# Altium project 1kW_BLDC_Controller.PrjPcb (part 2 of 2)

## Sheet Optocouplers.SchDoc
size A4; SheetNumber: 5; SheetTotal: 9
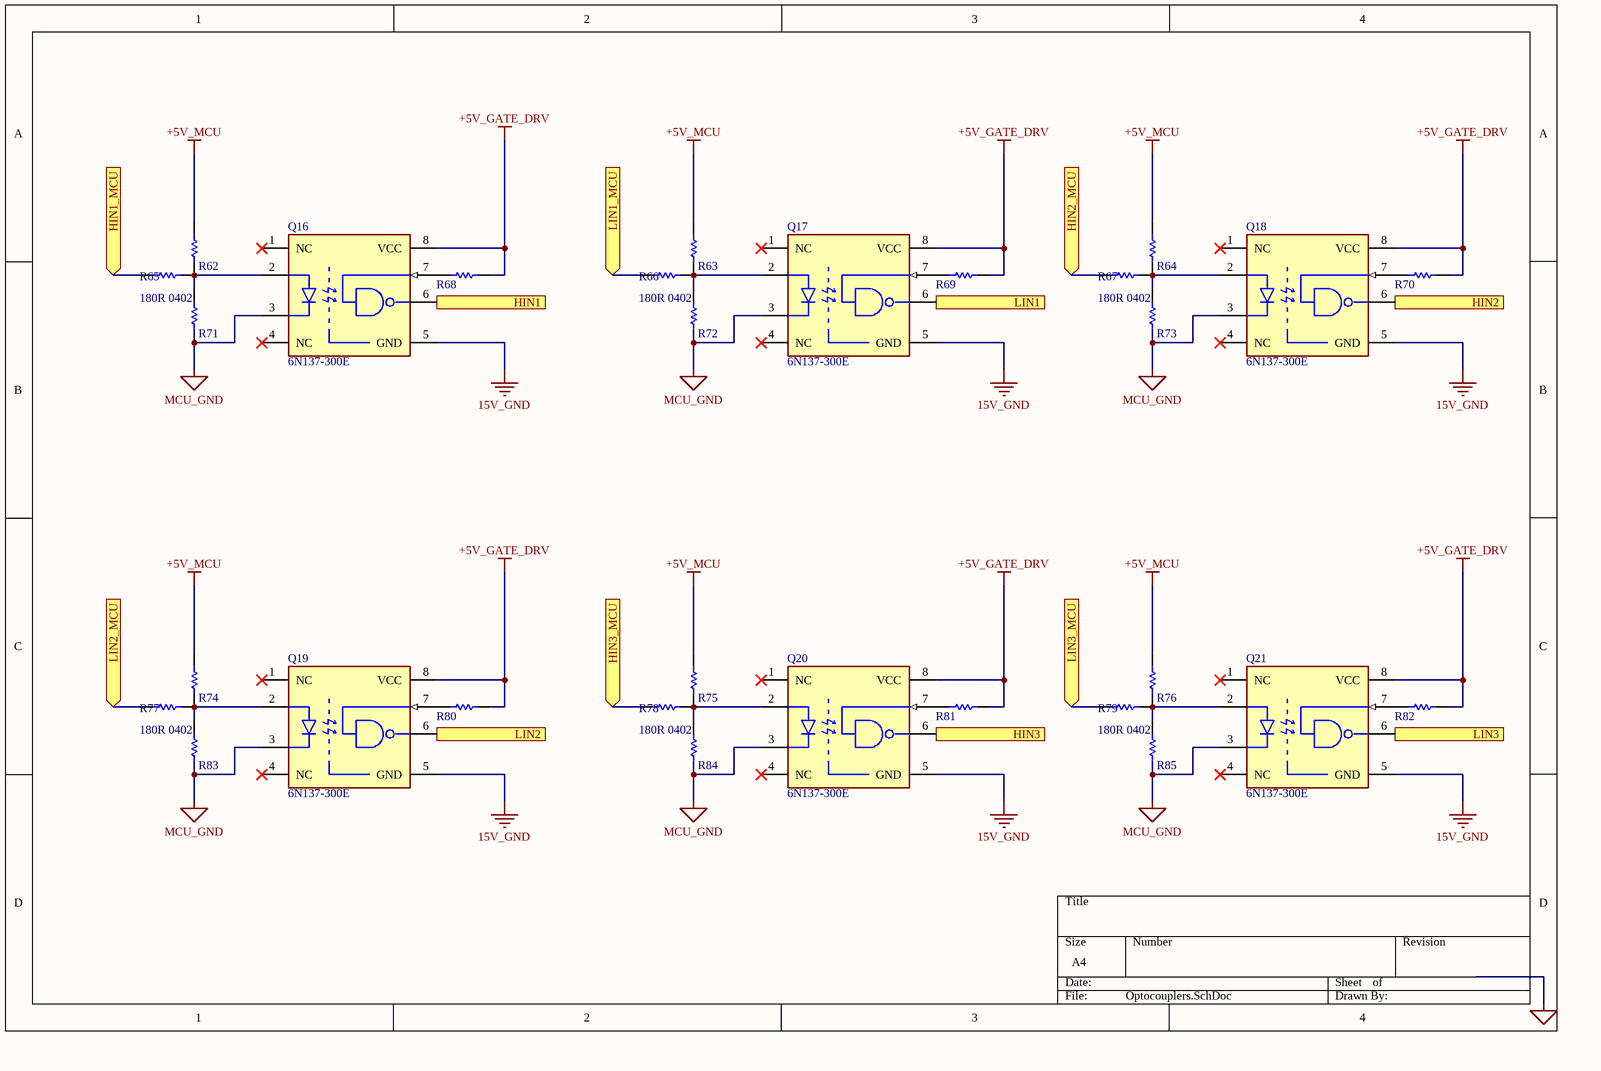
[diagram p4: Optocouplers.SchDoc]

### Parts
Q16  6N137-300E  [FP-6N137-300E-MFG]
Q17  6N137-300E  [FP-6N137-300E-MFG]
Q18  6N137-300E  [FP-6N137-300E-MFG]
Q19  6N137-300E  [FP-6N137-300E-MFG]
Q20  6N137-300E  [FP-6N137-300E-MFG]
Q21  6N137-300E  [FP-6N137-300E-MFG]
R62  0R 0603  [R0603]  (value not drawn)
R63  0R 0603  [R0603]  (value not drawn)
R64  0R 0603  [R0603]  (value not drawn)
R65  180R 0402  [R08050402]
R66  180R 0402  [R08050402]
R67  180R 0402  [R08050402]
R68  0R 0603  [R0603]  (value not drawn)
R69  0R 0603  [R0603]  (value not drawn)
R70  0R 0603  [R0603]  (value not drawn)
R71  0R 0603  [R0603]  (value not drawn)
R72  0R 0603  [R0603]  (value not drawn)
R73  0R 0603  [R0603]  (value not drawn)
R74  0R 0603  [R0603]  (value not drawn)
R75  0R 0603  [R0603]  (value not drawn)
R76  0R 0603  [R0603]  (value not drawn)
R77  180R 0402  [R08050402]
R78  180R 0402  [R08050402]
R79  180R 0402  [R08050402]
R80  0R 0603  [R0603]  (value not drawn)
R81  0R 0603  [R0603]  (value not drawn)
R82  0R 0603  [R0603]  (value not drawn)
R83  0R 0603  [R0603]  (value not drawn)
R84  0R 0603  [R0603]  (value not drawn)
R85  0R 0603  [R0603]  (value not drawn)

### Ports
HIN1 (out), HIN1_MCU (in), HIN2 (out), HIN2_MCU (in), HIN3 (out), HIN3_MCU (in), LIN1 (out), LIN1_MCU (in), LIN2 (out), LIN2_MCU (in), LIN3 (out), LIN3_MCU (in)

### Nets
15V_GND: Q16.5(GND) Q17.5(GND) Q18.5(GND) Q19.5(GND) Q20.5(GND) Q21.5(GND)
+5V_GATE_DRV: Q16.8(VCC) Q17.8(VCC) Q18.8(VCC) Q19.8(VCC) Q20.8(VCC) Q21.8(VCC) R68.2 R69.2 R70.2 R80.2 R81.2 R82.2
+5V_MCU: R62.2 R63.2 R64.2 R74.2 R75.2 R76.2
MCU_GND: Q16.3(C) Q17.3(C) Q18.3(C) Q19.3(C) Q20.3(C) Q21.3(C) R71.1 R72.1 R73.1 R83.1 R84.1 R85.1  [project net A_GND]
NetH8_54: R79.1 ; port LIN3_MCU
NetH8_56: R77.1 ; port LIN2_MCU
NetH8_58: R66.1 ; port LIN1_MCU
NetH8_60: R78.1 ; port HIN3_MCU
NetH8_62: R67.1 ; port HIN2_MCU
NetH8_64: R65.1 ; port HIN1_MCU
NetQ16_2: Q16.2(A) R62.1 R65.2 R71.2
NetQ16_6: Q16.6(VO) ; port HIN1
NetQ16_7: Q16.7(VE) R68.1
NetQ17_2: Q17.2(A) R63.1 R66.2 R72.2
NetQ17_6: Q17.6(VO) ; port LIN1
NetQ17_7: Q17.7(VE) R69.1
NetQ18_2: Q18.2(A) R64.1 R67.2 R73.2
NetQ18_6: Q18.6(VO) ; port HIN2
NetQ18_7: Q18.7(VE) R70.1
NetQ19_2: Q19.2(A) R74.1 R77.2 R83.2
NetQ19_6: Q19.6(VO) ; port LIN2
NetQ19_7: Q19.7(VE) R80.1
NetQ20_2: Q20.2(A) R75.1 R78.2 R84.2
NetQ20_6: Q20.6(VO) ; port HIN3
NetQ20_7: Q20.7(VE) R81.1
NetQ21_2: Q21.2(A) R76.1 R79.2 R85.2
NetQ21_6: Q21.6(VO) ; port LIN3
NetQ21_7: Q21.7(VE) R82.1

Not connected (* = marked no-connect by the designer): Q16 1(NC)* 4(NC)*; Q17 1(NC)* 4(NC)*; Q18 1(NC)* 4(NC)*; Q19 1(NC)* 4(NC)*; Q20 1(NC)* 4(NC)*; Q21 1(NC)* 4(NC)*

### Library data of the parts
Q16-Q21 = CMP-18400-000015-1: 6N137 – High-Speed Optocoupler-SOP8; Manufacturer: Broadcom; Min Supply Voltage: 4.5V; Forward Voltage: 1.5V; Turn Off Delay Time: 50ns; Standoff Height: 0.505mm; Reverse Voltage: 5V; Isolation Voltage: 3750Vrms; Forward Current: 10mA; Turn On Delay Time: 48ns; Max Supply Voltage: 5.5V; Package: 0; Automotive: No; Lead Free: Yes; ComponentLink2Description: Datasheet; Temperature: -40°C to +85°C; Device Class L3: unset; Height: 4.455mm; Ambient Temperature Range Low: -40°C; Digikey Description: OPTOISO 3.75KV OPN COLL 8DIP GW; Temperature Range Low: -40°C; ComponentLink2URL: https://docs.broadcom.com/docs/AV02-0940EN; Mouser Description: High Speed Optocouplers 10 Mb/s 3750Vrms; Category: Trans; Ambient Temperature Range High: +85°C; RoHS: TRUE; Octopart: https://octopart.com/6n137-300e-broadcom-71125550; Manufacturer Part Number: 6N137-300E; Device Class L1: Optoelectronics; Device Class L2: Optocouplers; Temperature Range High: +85°C; Price per piece: 36; Product URL: https://sharvielectronics.com/product/6n137-high-speed-optocoupler-sop8/; Datasheet: https://sharvielectronics.com/wp-content/uploads/2020/11/6n137.pdf
  Q17-Q21: Parameter 1: *
R62-R64 R68-R76 R80-R85 = R0000 0603: 0 Ohm 1/10 Watt Resistor 1% Tolerance RC0603FR-070RL – 0603 Package; Price per piece: 0.97; Product URL: https://sharvielectronics.com/product/0-ohm-1-10-watt-resistor-1-tolerance-rc0603fr-070rl-0603-package/; Datasheet: https://drive.google.com/file/d/1pkLQT_RQ1i35oFQcGREpZr7Oy3Ppi-ZT/view?usp=sharing
R65-R67 R77-R79 = R0805-0402: 180 Ohm 1/4 Watt Resistor – 0402 Package; Price per piece: 0.85; Product URL: https://sharvielectronics.com/product/180-ohm-1-4-watt-resistor-0402-package-pack-of-20/; Datasheet: https://sharvielectronics.com/wp-content/uploads/2020/09/smd_Resistor_0603_0805_1206.pdf

## Sheet optocouplers2.SchDoc
size A4; SheetNumber: 6; SheetTotal: 9
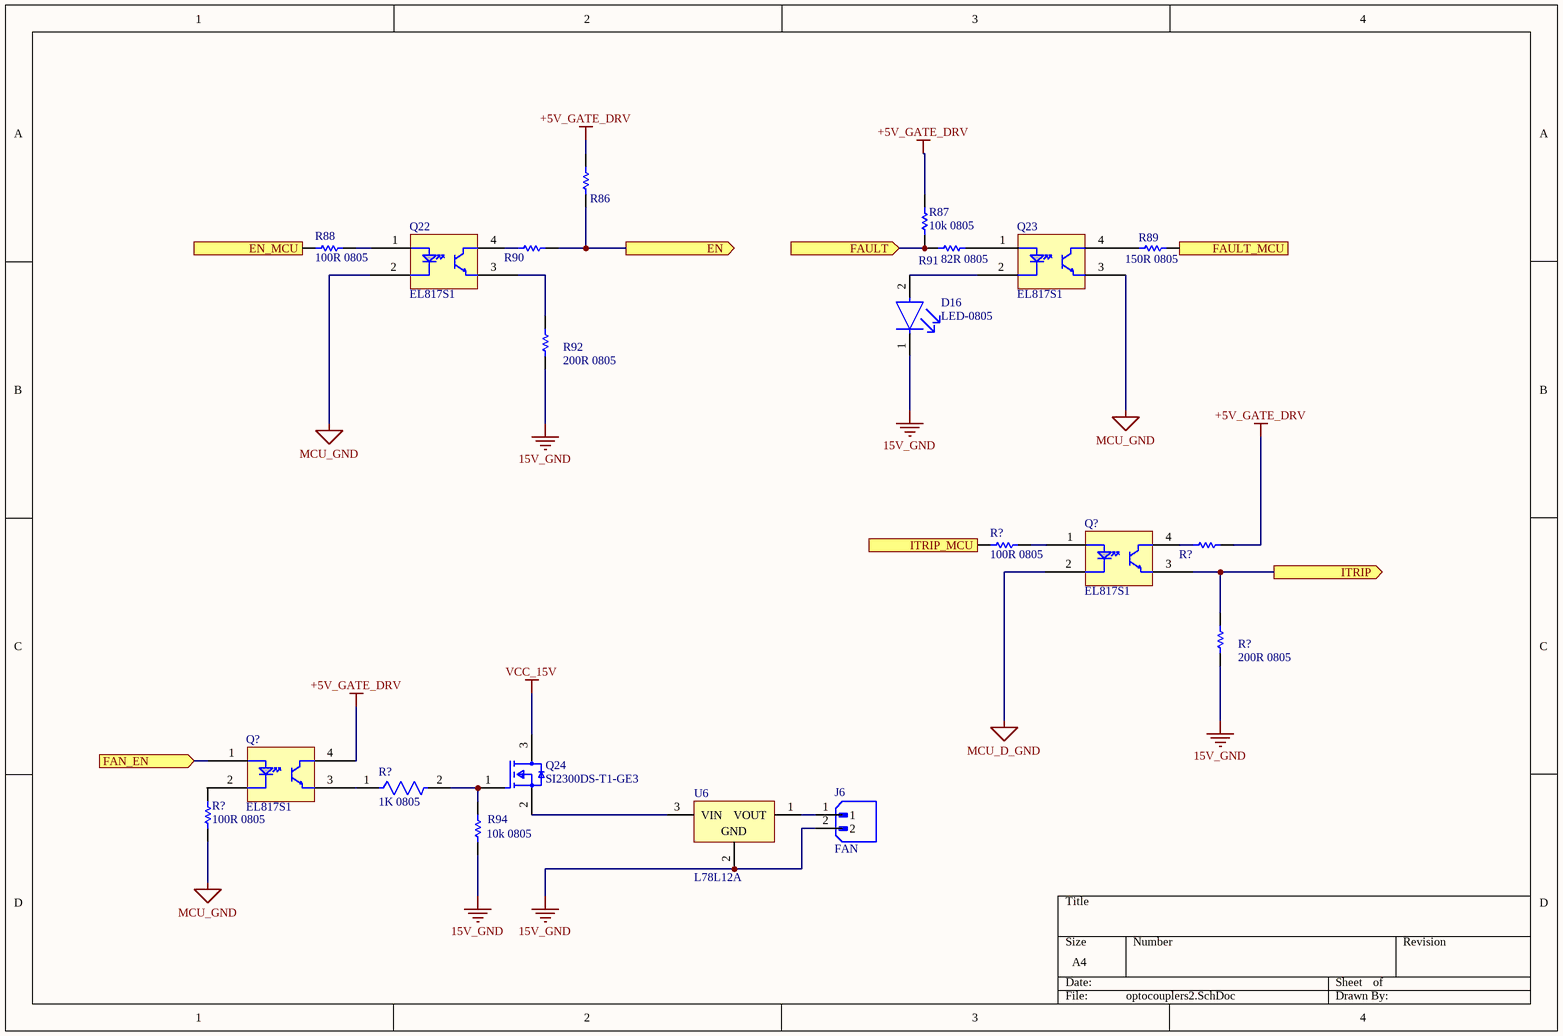
[diagram p5: optocouplers2.SchDoc]

### Parts
(Parts that share a designator on the sheet are numbered #1, #2 ... from top to bottom, then left to right.)
D16  LED-0805  [LED0805]
J6  FAN  [XH2.5-2p]
Q22  EL817S1  [EL817S1]
Q23  EL817S1  [EL817S1]
Q24  SI2300DS-T1-GE3  [FP-S-03946-MFG]
Q?#1  EL817S1  [EL817S1]
Q?#2  EL817S1  [EL817S1]
R86  0R 0603  [R0603]  (value not drawn)
R87  10k 0805  [R0805]
R88  100R 0805  [R0805]
R89  150R 0805  [R0805]
R90  0R 0603  [R0603]  (value not drawn)
R91  82R 0805  [R0805]
R92  200R 0805  [R0805]
R94  10k 0805  [R0805]
R?#2  100R 0805  [R0805]
R?#3  0R 0603  [R0603]  (value not drawn)
R?#4  200R 0805  [R0805]
R?#5  1K 0805  [R0805]
R?#6  100R 0805  [R0805]
U6  L78L12A  [SOT-89_L]

### Ports
EN (out), EN_MCU (in), FAN_EN (in), FAULT (in), FAULT_MCU (out), ITRIP (out), ITRIP_MCU (in)

### Nets
15V_GND: D16.1(C) J6.2 R92.1 R94.1 R?#4.1 U6.2(GND)
+5V_GATE_DRV: Q?#2.4(C) R86.2 R87.2 R?#3.2
MCU_D_GND: Q?#1.2(K)
MCU_GND: Q22.2(K) Q23.3(E) R?#6.1  [project net A_GND]
VCC_15V: Q24.3(D)
NetD16_2: D16.2(A) Q23.2(K)
NetH8_47: Q?#2.1(A) ; port FAN_EN
NetH8_50: R88.1 ; port EN_MCU
NetH8_51: R89.2 ; port FAULT_MCU
NetJ6_1: J6.1 U6.1(VOUT)
NetQ22_1: Q22.1(A) R88.2
NetQ22_3: Q22.3(E) R92.2
NetQ22_4: Q22.4(C) R90.1
NetQ23_1: Q23.1(A) R91.2
NetQ23_4: Q23.4(C) R89.1
NetQ24_1: Q24.1(G) R94.2 R?#5.2
NetQ24_2: Q24.2(S) U6.3(VIN)
NetQ?#1_1: Q?#1.1(A) R?#2.2
NetQ?#1_3: Q?#1.3(E) R?#4.2 ; port ITRIP
NetQ?#1_4: Q?#1.4(C) R?#3.1
NetQ?#2_3: Q?#2.3(E) R?#5.1
NetR32_1: R86.1 R90.2 ; port EN
NetR33_1: R87.1 R91.1 ; port FAULT
NetR38_2: R?#2.1 ; port ITRIP_MCU

Not connected (* = marked no-connect by the designer): Q?#2 2(K); R?#6 2

### Library data of the parts
D16 = LED-0805: Red LED – 0805 SMD Package – 17-21SURC/S530-A3/TR8; Price per piece: 2.32; Product URL: https://sharvielectronics.com/product/red-led-0805-smd-package-17-21surc-s530-a3-tr8/; Datasheet: https://drive.google.com/file/d/193qGY45iPx2JlzACJk7ZLn2axHlG04VY/view?usp=sharing
J6 = XH2.5-2p: 2 Pin JST-XH Male Straight 2515 Connector 2.54mm Pitch; Price per piece: 1.65; Product URL: https://sharvielectronics.com/product/2-pin-jst-xh-male-straight-2515-connector-2-54mm-pitch/; Datasheet: https://sharvielectronics.com/wp-content/uploads/2021/01/XH-Connector.pdf
Q22 Q23 Q?#1 Q?#2 = EL817S1: EL817S1 (B) (TU) – F Optocoupler SMD-4 Cut Tape; Product URL: https://sharvielectronics.com/product/el817s1-b-tu-f-optocoupler-smd-4-cut-tape/; Price per piece: 7.45; Datasheet: https://sharvielectronics.com/wp-content/uploads/2021/09/EL817-Optocoupler.pdf
Q24 = CMP-02550-000182-1: SI2300DS 30V 3.6A N-Channel Mosfet – SOT-23 Package; Manufacturer: Vishay; Threshold Vgs Max: 1.5V; Max Forward Diode Voltage: 1.2V; Max Junction Temp: +150°C; Reverse Recovery Time: 11ns; Depletion Mode: False; Standoff Height: 0.01mm; Gate To Source Voltage: 12V; Input Capacitace At Vds: 320pF @ 15V; Turn Off Delay Time: 15ns; Threshold Vgs Min: 0.6V; Transconductance: 13S; Gate Charge At Vgs: 6.5nC @ 10V; Power Dissipation: 1.1W; Drain To Source Resistance: 0.055Ω; Number Of N Channels: 1; Pulse Drain Current: 15A; Continuous Drain Current: 3.1A; Typ Forward Diode Voltage: 0.8V; Reverse Recovery Charge: 5nC; Rthja Max: 90°C/W; Turn On Delay Time: 5ns; Device Class L2: Transistors; Digikey Description: MOSFET N-CH 30V 3.6A SOT-23; Device Class L3: MOSFETs; ComponentLink2Description: Datasheet; Height: 1.12mm; Temperature Range Low: -55°C; Package: S-03946; Device Class L1: Discrete Semiconductors; RoHS: TRUE; ComponentLink2URL: http://www.vishay.com/docs/65701/si2300ds.pdf; Category: Trans; Drain To Source Breakdown Voltage: 30V; Automotive: No; Number Of Channels: 1; Mouser Description: MOSFET 30V 3.6A N-CH MOSFET; Temperature: -55°C to +150°C; Manufacturer Part Number: SI2300DS-T1-GE3; Octopart: https://octopart.com/si2300ds-t1-ge3-vishay-44451512; Drain To Source Voltage: 30V; Lead Free: Yes; Temperature Range High: +150°C; Ipc Land Pattern Name: SOT95P237X100-3; Price per piece: 12.5; Product URL: https://sharvielectronics.com/product/si2300ds-30v-3-6a-n-channel-mosfet-sot-23-package/; Datasheet: https://www.vishay.com/docs/65701/si2300ds.pdf
R86 R90 R?#3 = R0000 0603: as R62 on sheet Optocouplers; Price per piece: 0.97; Product URL: https://sharvielectronics.com/product/0-ohm-1-10-watt-resistor-1-tolerance-rc0603fr-070rl-0603-package/; Datasheet: https://drive.google.com/file/d/1pkLQT_RQ1i35oFQcGREpZr7Oy3Ppi-ZT/view?usp=sharing
R87 R94 = 10k 0805: 10K Ohm 1/8 Watt Resistor 1% Tolerance RC0805FR-0710KL – 0805 Package; Price per piece: 0.82; Product URL: https://sharvielectronics.com/product/10k-ohm-1-8-watt-resistor-1-tolerance-rc0805fr-0710kl-0805-package/; Datasheet: https://drive.google.com/file/d/1pkLQT_RQ1i35oFQcGREpZr7Oy3Ppi-ZT/view?usp=sharing
R88 R?#2 R?#6 = 100R 0805: 100 ohm 1/4W Resistor 0805 Package; Price per piece: 0.82; Product URL: https://sharvielectronics.com/product/100-ohm-1-4w-resistor-0805-package/; Datasheet: *
R89 = R0805: 510 Ohm 1/8 Watt Resistor 1% Tolerance 0805S8F5100T5E – 0805 Package; Price per piece: 0.85; Product URL: https://sharvielectronics.com/product/510-ohm-1-8-watt-resistor-1-tolerance-0805s8f5100t5e-0805-package/; Datasheet: https://drive.google.com/file/d/1rtx85iFJaMrDbsv7PAzG9bTFItPmAE38/view
R91 = R0805: 82 ohm – 1/4W – Resistor – 0805; Price per piece: 0.82; Product URL: https://sharvielectronics.com/product/82-ohm-1-4w-resistor-pack-of-20-smd-0805/; Datasheet: https://sharvielectronics.com/wp-content/uploads/2020/09/smd_Resistor_0603_0805_1206.pdf
R92 R?#4 = R0805: 200 Ohm 1/8 Watt Resistor 1% Tolerance 0805W8F2000TE – 0805 Package; Price per piece: 0.82; Product URL: https://sharvielectronics.com/product/200-ohm-1-8-watt-resistor-1-tolerance-0805w8f2000te-0805-package/; Datasheet: https://drive.google.com/file/d/1rtx85iFJaMrDbsv7PAzG9bTFItPmAE38/view?usp=sharing
R?#5 = 1k 0805: 1K Ohm 1/8 Watt Resistor 1% Tolerance 0805S8F1001T5E – 0805 Package; Price per piece: 0.82; Product URL: https://sharvielectronics.com/product/1k-ohm-1-8-watt-resistor-1-tolerance-0805s8f1001t5e-0805-package/; Datasheet: https://drive.google.com/file/d/1rtx85iFJaMrDbsv7PAzG9bTFItPmAE38/view?usp=sharing
U6 = CMP-0244-00387-1: 78L12 – 12V 150mA Positive Voltage Regulator-SOT-89 Package; DatasheetVersion: 1/02/2011; PackageDescription: 3-Pin SOT-89 Package 1.5 mm Pitch, 4.1 mm Lead Span; ComponentLink2Description: Datasheet; ComponentLink1Description: Manufacturer URL; PackageVersion: 2011; PackageReference: SOT-89; ComponentLink1URL: http://www.st.com; ComponentLink2URL: http://www.st.com/internet/com/TECHNICAL_RESOURCES/TECHNICAL_LITERATURE/DATASHEET/CD00000446.pdf; Price per piece: 13.32; Product URL: https://sharvielectronics.com/product/78l12-12v-150ma-positive-voltage-regulator-sot-89-package/; Datasheet: https://drive.google.com/file/d/1zOSy_FqMAdv1iXKmyJwn0G3RjMYeVW2a/view?usp=sharing

## Sheet Precharge circuit.SchDoc
size A4; SheetNumber: 7; SheetTotal: 9
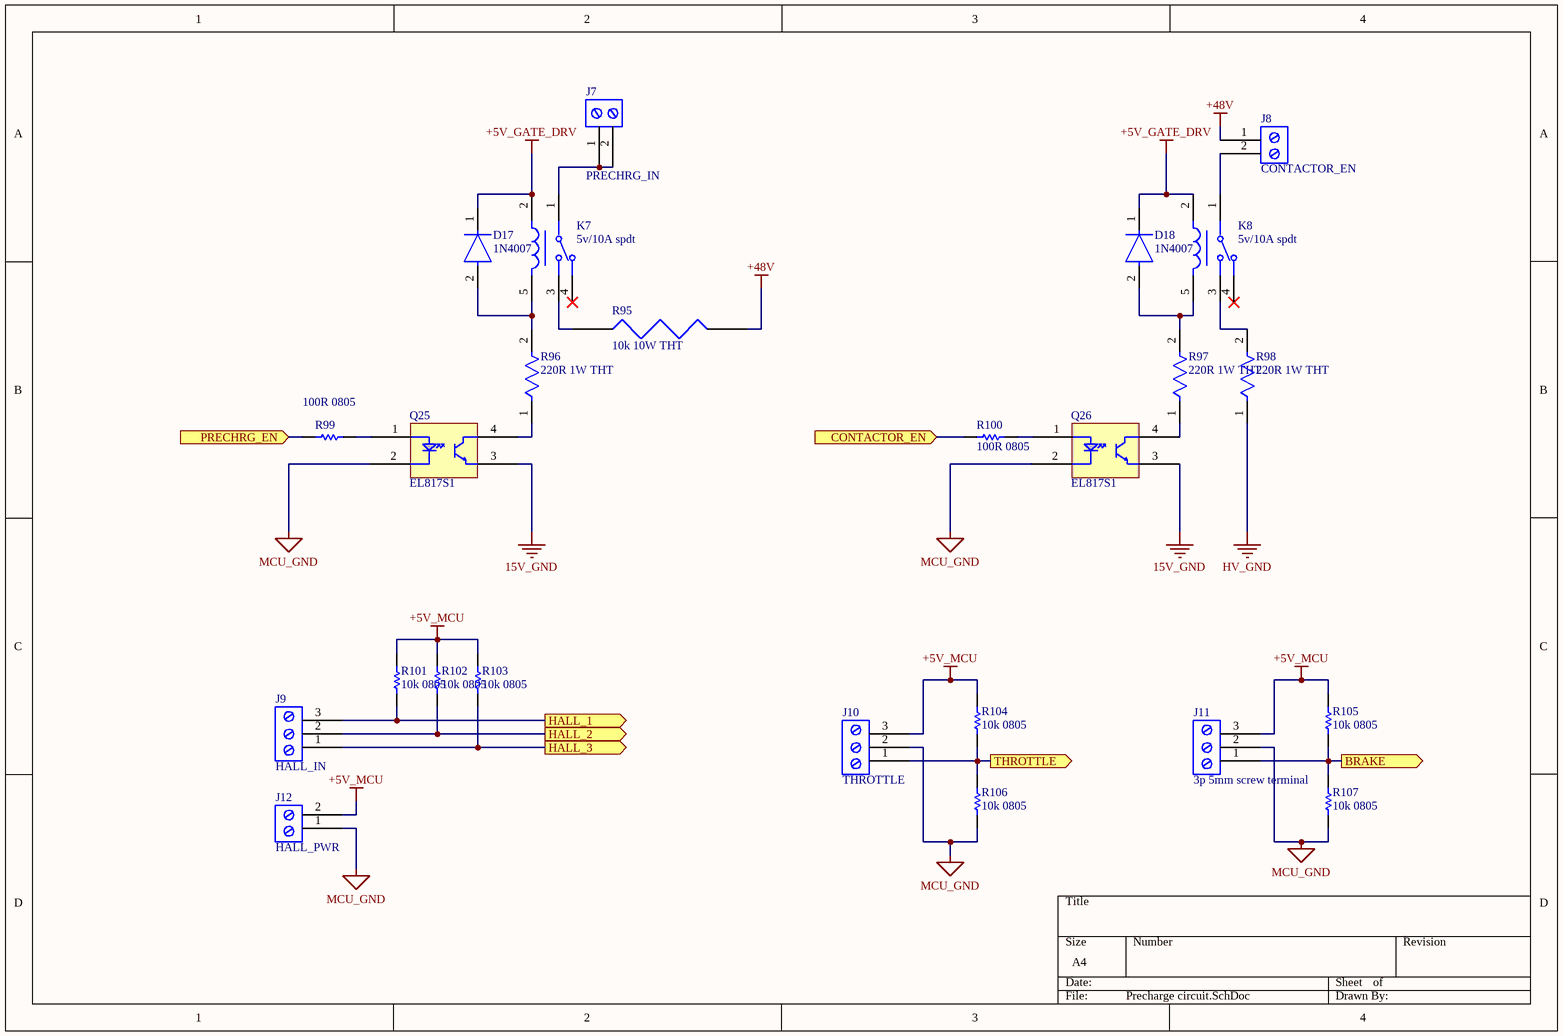
[diagram p6: Precharge circuit.SchDoc]

### Parts
D17  1N4007  [FP-1N4007-MFG]
D18  1N4007  [FP-1N4007-MFG]
J7  PRECHRG_IN  [TERMINAL_5MM_2P]
J8  CONTACTOR_EN  [TERMINAL_5MM_2P]
J9  HALL_IN  [TERMINAL_5MM_3P]
J10  THROTTLE  [TERMINAL_5MM_3P]
J11  3p 5mm screw terminal  [TERMINAL_5MM_3P]
J12  HALL_PWR  [TERMINAL_5MM_2P]
K7  5v/10A spdt  [FP-G5LE-1-E-36-DC5-MFG]
K8  5v/10A spdt  [FP-G5LE-1-E-36-DC5-MFG]
Q25  EL817S1  [EL817S1]
Q26  EL817S1  [EL817S1]
R95  10k 10W THT  [R10W]
R96  220R 1W THT  [R1WTHT]
R97  220R 1W THT  [R1WTHT]
R98  220R 1W THT  [R1WTHT]
R99  100R 0805  [R0805]
R100  100R 0805  [R0805]
R101  10k 0805  [R0805]
R102  10k 0805  [R0805]
R103  10k 0805  [R0805]
R104  10k 0805  [R0805]
R105  10k 0805  [R0805]
R106  10k 0805  [R0805]
R107  10k 0805  [R0805]

### Ports
BRAKE (out), CONTACTOR_EN (in), HALL_1 (out), HALL_2 (out), HALL_3 (out), PRECHRG_EN (in), THROTTLE (out)

### Nets
15V_GND: Q25.3(E) Q26.3(E)
+5V_GATE_DRV: D17.1(C) D18.1(C) K7.2 K8.2
+5V_MCU: J10.3 J11.3 J12.2 R101.2 R102.2 R103.2 R104.2 R105.2
+48V: J8.1 R95.2
HV_GND: R98.1
MCU_GND: J10.2 J11.2 J12.1 Q25.2(K) Q26.2(K) R106.1 R107.1  [project net A_GND]
NetD17_2: D17.2(A) K7.5 R96.2
NetD18_2: D18.2(A) K8.5 R97.2
NetH8_19: J10.1 R104.1 R106.2 ; port THROTTLE
NetH8_21: J11.1 R105.1 R107.2 ; port BRAKE
NetH8_29: J9.3 R101.1 ; port HALL_1
NetH8_30: J9.2 R102.1 ; port HALL_2
NetH8_31: J9.1 R103.1 ; port HALL_3
NetH8_48: R100.1 ; port CONTACTOR_EN
NetH8_49: R99.1 ; port PRECHRG_EN
NetJ7_1: J7.1 J7.2 K7.1
NetJ8_2: J8.2 K8.1
NetK7_3: K7.3 R95.1
NetK8_3: K8.3 R98.2
NetQ25_1: Q25.1(A) R99.2
NetQ25_4: Q25.4(C) R96.1
NetQ26_1: Q26.1(A) R100.2
NetQ26_4: Q26.4(C) R97.1

Not connected (* = marked no-connect by the designer): K7 4*; K8 4*

### Library data of the parts
D17 D18 = CMP-123542-000001-1: GOOD-ARK 1N4007 General Purpose Rectifier Diode – DO-41 Package; Manufacturer: Diotec; Max Surge Forward Current: 27A; Forward Current: 1A; Max Junction Temp: +175°C; Reverse Voltage: 1000V; Value: 15pF; Peak Reverse Current: 5uA; Category: Diode; Temperature Range Low: -50°C; Automotive: No; Temperature: -50°C to +175°C; Lead Free: Yes; ComponentLink2Description: Datasheet; Max Repetitive Reverse Voltage: 1000V; ComponentLink2URL: https://datasheet.octopart.com/1N4007-Diotec-datasheet-62346875.pdf; Manufacturer Part Number: 1N4007; Device Class L3: Rectifier Diodes; Height: 2.8mm; Octopart: https://octopart.com/1n4007-diotec-4040411; Package: 1N4007; Temperature Range High: +175°C; Device Class L1: Discrete Semiconductors; Device Class L2: Diodes; RoHS: TRUE; Capacitance: 15pF; Ipc Land Pattern Name: DIOAD888W100L520D280; Product URL: https://sharvielectronics.com/product/good-ark-1n4007-general-purpose-rectifier-diode-do-41-package/; Price per piece: 1.29; Datasheet: https://sharvielectronics.com/wp-content/uploads/2020/02/1N4007-Diode-Good-Ark.pdf
J7 J8 J12 = 2p 5mm screw terminal: XY127- 2 Pin Screw Terminal- 5mm Pitch; Product URL: https://sharvielectronics.com/product/2-pin-screw-terminal-block-red-5mm-pitch/; Price per piece: 6.32; Datasheet: https://sharvielectronics.com/wp-content/uploads/2023/03/XY127.pdf
J9-J11 = 3p 5mm screw terminal: XY127- 3 Pin Screw Terminal- 5mm Pitch; Product URL: https://sharvielectronics.com/product/xy127-3-pin-screw-terminal-5mm-pitch/; Price per piece: 8.35; Datasheet: https://sharvielectronics.com/wp-content/uploads/2023/03/XY127.pdf
K7 K8 = CMP-08822-000056-1: HF3FF/005-1ZST – 05V 10A SPDT Relay – Hongfa; Coil Voltage (DC): 5V; Coil Type: Non-Latching; Relay Type: General Purpose; Power Consumption: 400mW; Coil Resistance: 70R; Release Time: 5ms; Coil Current: 72mA; Coil Power: 360mW; Operate Time: 10ms; Contact Current Rating: 16A; Max Operating Temperature: 85°C; Contact Material: Tin; Package Quantity: 100; Throw Configuration: SPDT; Termination: PC Pin; Series: G5LE-E; Packaging: Tray; Min Operating Temperature: -40°C; Mount: Through Hole; Price per piece: 29.23; Product URL: https://sharvielectronics.com/product/hf3ff-005-1zst-05v-10a-spdt-relay-hongfa/; Datasheet: https://drive.google.com/file/d/1_hoLs5DHKocXjc-HuLXelOv-fi3k6HGm/view?usp=sharing
Q25 Q26 = EL817S1: as Q22 on sheet optocouplers2; Product URL: https://sharvielectronics.com/product/el817s1-b-tu-f-optocoupler-smd-4-cut-tape/; Price per piece: 7.45; Datasheet: https://sharvielectronics.com/wp-content/uploads/2021/09/EL817-Optocoupler.pdf
R95 = 10k_10W_THT: 10K ohm 10W Fusible Cement Resistor; Price per piece: 20; Product URL: https://sharvielectronics.com/product/10k-ohm-10w-fusible-cement-resistor/; Datasheet: *
R96-R98 = 220R 1W THT: 220 Ohm 1 Watt Resistor 5% Tolerance; Price per piece: 1.46; Product URL: https://sharvielectronics.com/product/220-ohm-1-watt-resistor-5-tolerance/; Datasheet: *
R99 R100 = 100R 0805: 100 ohm 1/4W Resistor 0805 Package; Price per piece: 0.82; Product URL: https://sharvielectronics.com/product/100-ohm-1-4w-resistor-0805-package/; Datasheet: *
R101-R107 = 10k 0805: as R87 on sheet optocouplers2; Price per piece: 0.82; Product URL: https://sharvielectronics.com/product/10k-ohm-1-8-watt-resistor-1-tolerance-rc0805fr-0710kl-0805-package/; Datasheet: https://drive.google.com/file/d/1pkLQT_RQ1i35oFQcGREpZr7Oy3Ppi-ZT/view?usp=sharing

## Sheet mcu.SchDoc
size A4; SheetNumber: 8; SheetTotal: 9
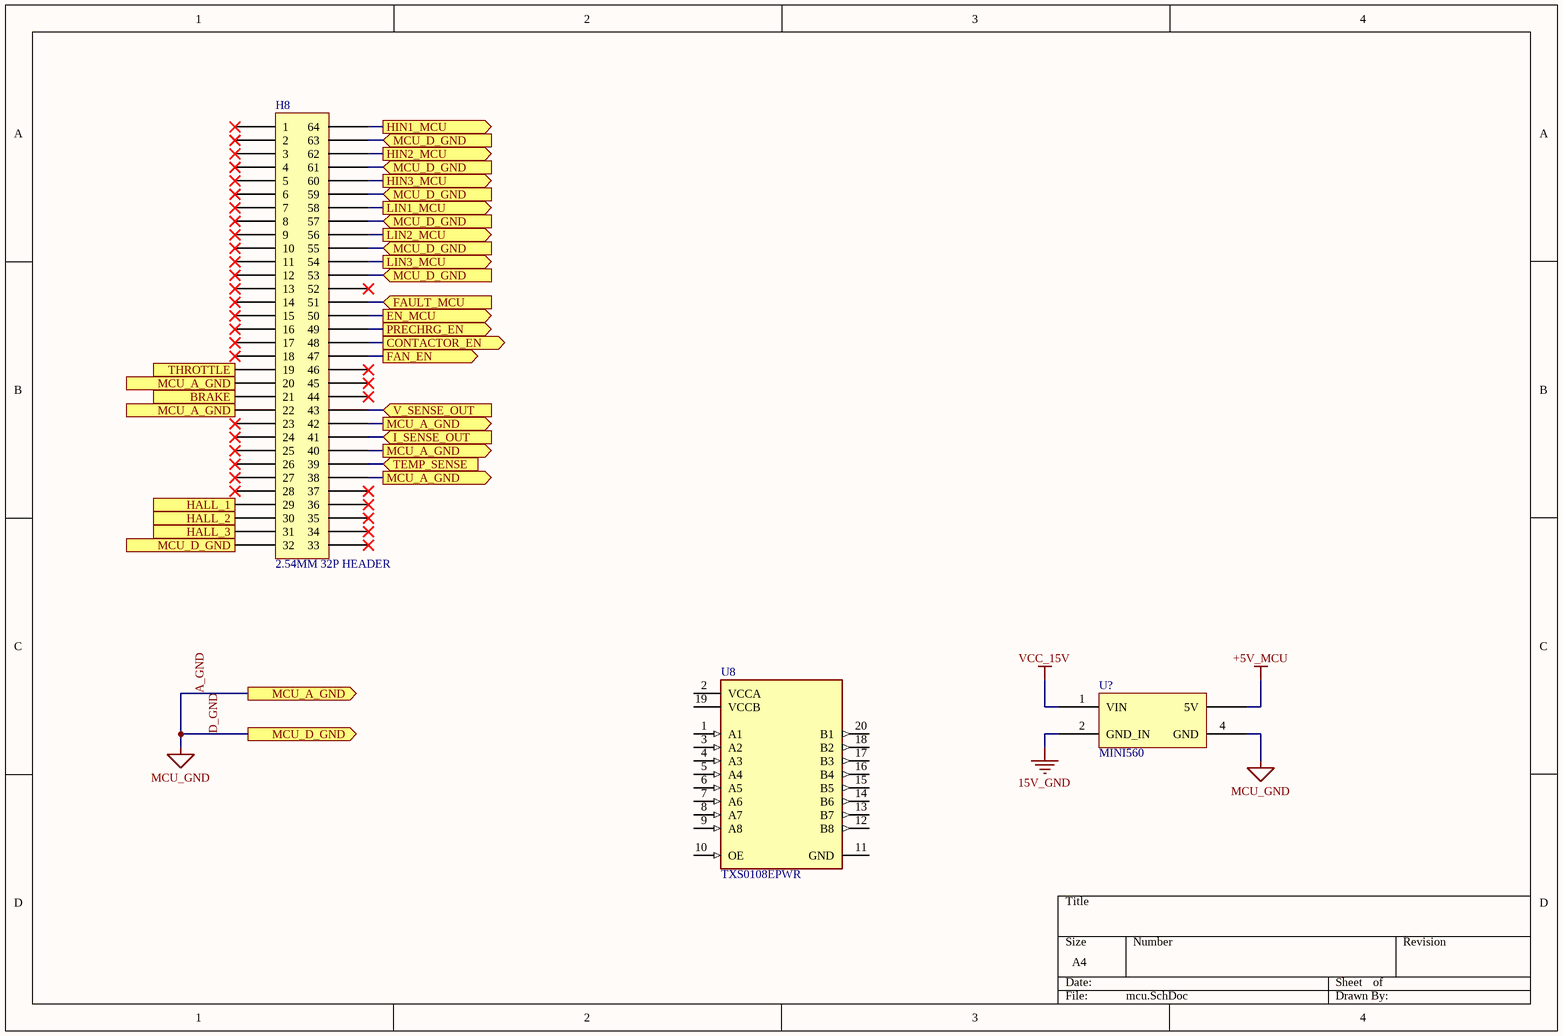
[diagram p7: mcu.SchDoc]

### Parts
H8  2.54MM 32P HEADER  [2.5mm 32p header]
U8  TXS0108EPWR  [FP-PW0020A-IPC_C]
U?  MINI560  [MINI560]

### Ports
BRAKE (in), CONTACTOR_EN (out), EN_MCU (out), FAN_EN (out), FAULT_MCU (in), HALL_1 (in), HALL_2 (in), HALL_3 (in), HIN1_MCU (out), HIN2_MCU (out), HIN3_MCU (out), I_SENSE_OUT (in), LIN1_MCU (out), LIN2_MCU (out), LIN3_MCU (out), MCU_A_GND (out), MCU_D_GND (in), MCU_D_GND (out), PRECHRG_EN (out), TEMP_SENSE (in), THROTTLE (in), V_SENSE_OUT (in)

### Nets
15V_GND: U?.2(GND_IN)
+5V_MCU: U?.3(5V)
A_GND: H8.20 H8.22 H8.32 H8.38 H8.40 H8.42 H8.53 H8.55 H8.57 H8.59 H8.61 H8.63 U?.4(GND) ; port MCU_D_GND, port MCU_A_GND  [also labelled D_GND, MCU_GND]
VCC_15V: U?.1(VIN)
NetC14_1: H8.39 ; port TEMP_SENSE
NetH8_19: H8.19 ; port THROTTLE
NetH8_21: H8.21 ; port BRAKE
NetH8_29: H8.29 ; port HALL_1
NetH8_30: H8.30 ; port HALL_2
NetH8_31: H8.31 ; port HALL_3
NetH8_41: H8.41 ; port I_SENSE_OUT
NetH8_43: H8.43 ; port V_SENSE_OUT
NetH8_47: H8.47 ; port FAN_EN
NetH8_48: H8.48 ; port CONTACTOR_EN
NetH8_49: H8.49 ; port PRECHRG_EN
NetH8_50: H8.50 ; port EN_MCU
NetH8_51: H8.51 ; port FAULT_MCU
NetH8_54: H8.54 ; port LIN3_MCU
NetH8_56: H8.56 ; port LIN2_MCU
NetH8_58: H8.58 ; port LIN1_MCU
NetH8_60: H8.60 ; port HIN3_MCU
NetH8_62: H8.62 ; port HIN2_MCU
NetH8_64: H8.64 ; port HIN1_MCU

Not connected (* = marked no-connect by the designer): H8 1* 2* 3* 4* 5* 6* 7* 8* 9* 10* 11* 12* 13* 14* 15* 16* 17* 18* 23* 24* 25* 26* 27* 28* 33* 34* 35* 36* 37* 44* 45* 46* 52*; U8 1(A1) 2(VCCA) 3(A2) 4(A3) 5(A4) 6(A5) 7(A6) 8(A7) 9(A8) 10(OE) 11(GND) 12(B8) 13(B7) 14(B6) 15(B5) 16(B4) 17(B3) 18(B2) 19(VCCB) 20(B1)

### Library data of the parts
H8 = 2.54MM 32P HEADER: 2×40 Pin Straight Female Berg Strip- 2.54mm Pitch; Price per piece: 13; Product URL: https://sharvielectronics.com/product/2x40-pin-straight-female-berg-strip-2-54mm-pitch/; Datasheet: https://sharvielectronics.com/wp-content/uploads/2020/02/Pin-Straight-Female-Berg-Strip-2.54mm-Pitch.pdf
U8 = CMP-2000-04956-2: IC TRNSLTR BIDIRECTIONAL 20TSSOP; Number of Inputs: 8; Supply Current: 8uA; Low Level Output Current: 50mA; Min Supply Voltage: 1.2V; Quiescent Current: 3uA; Output Type: Voltage; Propagation Delay: 4.8ns; Max Supply Voltage: 5.5V; Output Current: 620uA; Turn-On Delay Time: 312ns; Logic Function: Translator; Data Rate: 60Mbps; Rise Time: 6.3ns; High Level Output Current: -50mA; Number of Pins: 20; Packaging: Tape and Reel; Max Operating Temperature: 85°C; Height: 1.15mm; Nominal Supply Current: 8uA; Termination: SMD/SMT; Lead Free: Lead Free; Package Quantity: 1; Number of Bits: 8; Weight: 0.002716oz; Contact Plating: Gold; Series: -; Width: 4.4mm; Radiation Hardening: No; Mount: Surface Mount; Length: 6.5mm; Case/Package: TSSOP; REACH SVHC: No SVHC; RoHS Compliant: Yes; Min Operating Temperature: -40°C; Number of Channels: 8
U? = MINI560: MINI560 5VDC 5A Step-Down Stabilized Module; Price per piece: 125.33; Product URL: https://sharvielectronics.com/product/mini560-5vdc-5a-step-down-stabilized-module/

## Sheet stm32.SchDoc
size A4; SheetNumber: 9; SheetTotal: 9
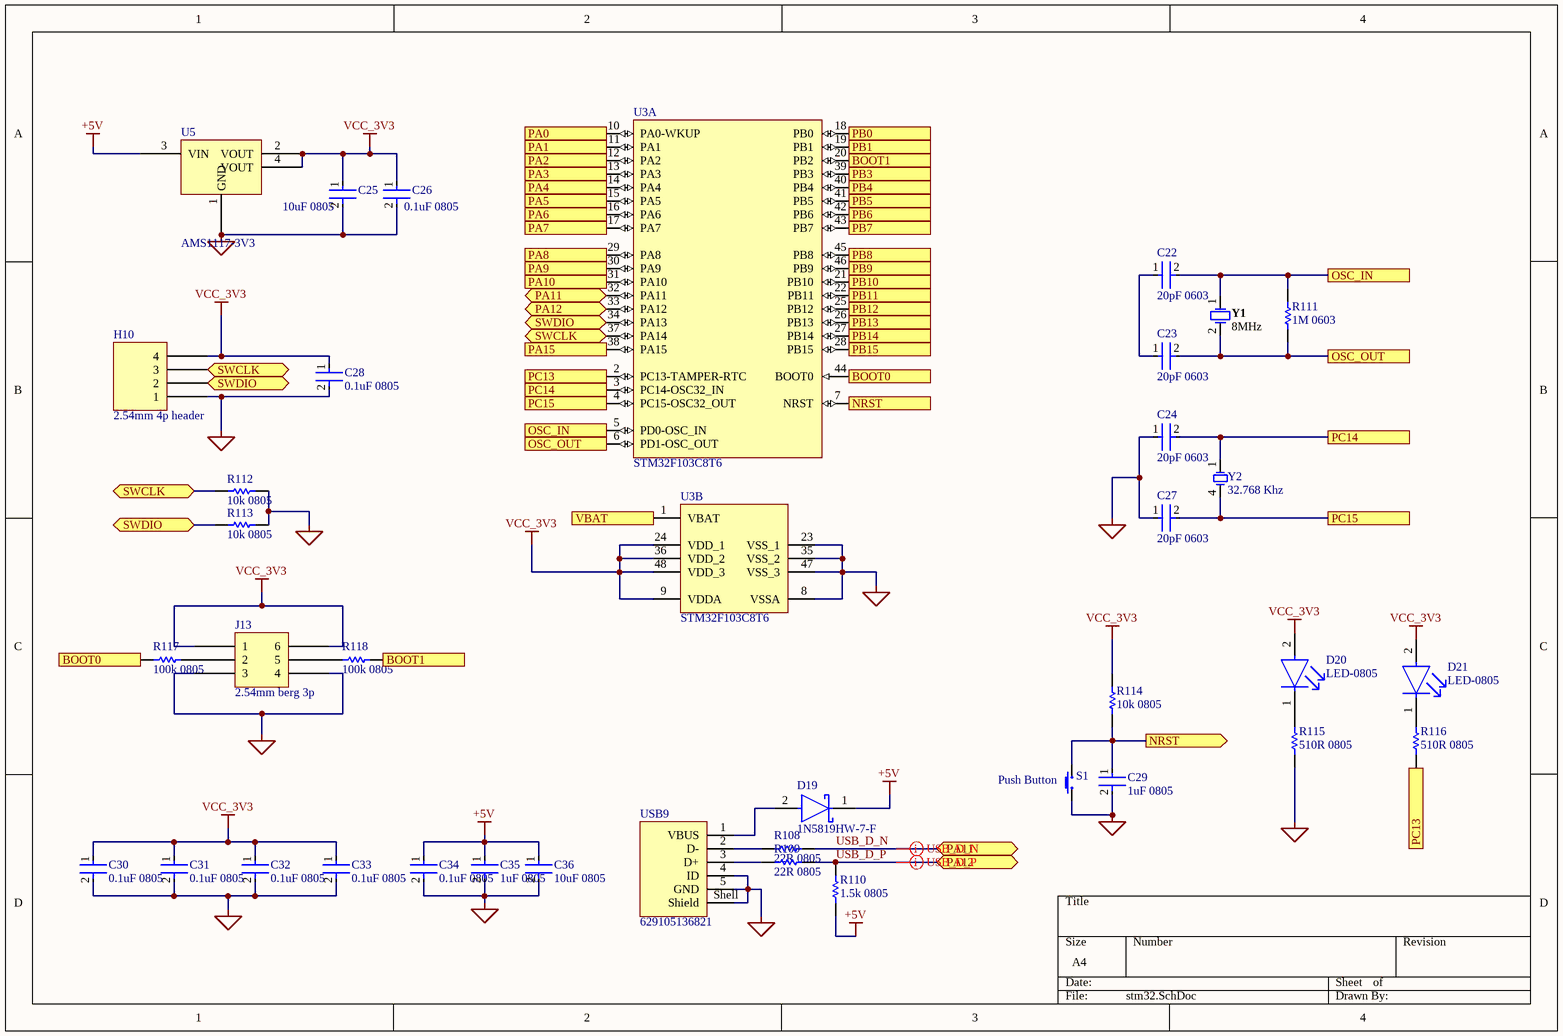
[diagram p8: stm32.SchDoc]

### Parts
C22  20pF 0603  [C0603]
C23  20pF 0603  [C0603]
C24  20pF 0603  [C0603]
C25  10uF 0805  [R0805]
C26  0.1uF 0805  [R0805]
C27  20pF 0603  [C0603]
C28  0.1uF 0805  [R0805]
C29  1uF 0805  [R0805]
C30  0.1uF 0805  [R0805]
C31  0.1uF 0805  [R0805]
C32  0.1uF 0805  [R0805]
C33  0.1uF 0805  [R0805]
C34  0.1uF 0805  [R0805]
C35  1uF 0805  [R0805]
C36  10uF 0805  [R0805]
D19  1N5819HW-7-F  [FP-SOD123-IPC_B]
D20  LED-0805  [LED0805]
D21  LED-0805  [LED0805]
H10  2.54mm 4p header  [2.54mm 4p header]
J13  2.54mm berg 3p  [2.54mm 3p header]
R108  22R 0805  [R0805]
R109  22R 0805  [R0805]
R110  1.5k 0805  [R0805]
R111  1M 0603  [R0603]
R112  10k 0805  [R0805]
R113  10k 0805  [R0805]
R114  10k 0805  [R0805]
R115  510R 0805  [R0805]
R116  510R 0805  [R0805]
R117  100k 0805  [R0805]
R118  100k 0805  [R0805]
S1  Push Button  [PBUTTON]
U3  STM32F103C8T6  [STM-LQFP48_L]  (parts A,B of 2)
U5  AMS1117-3V3  [AMS1117-3V3]
USB9  629105136821  [629105136821]
Y1  8MHz  [FOX-HC49SDLF_V]
Y2  32.768 Khz  [XTAL]

### Ports
BOOT0 (in), BOOT0 (out), BOOT1 (in), BOOT1 (out), NRST (in), NRST (out), OSC_IN, OSC_OUT, PA0, PA1, PA2, PA3, PA4, PA5, PA6, PA7, PA8, PA9, PA10, PA11 (bidir), PA12 (bidir), PA15, PB0, PB1, PB3, PB4, PB5, PB6, PB7, PB8, PB9, PB10, PB11, PB12, PB13, PB14, PB15, PC13 (in), PC13 (out), PC14, PC15, SWCLK (bidir), SWDIO (bidir), VBAT

### Nets
+5V: C34.1 C35.1 C36.1 D19.1(C) R110.1 U5.3(VIN)
GND: C24.1 C25.2 C26.2 C27.1 C28.2 C29.2 C30.2 C31.2 C32.2 C33.2 C34.2 C35.2 C36.2 H10.1 J13.3 J13.4 R112.2 R113.2 R115.1 S1.1 U3.8(VSSA) U3.23(VSS_1) U3.35(VSS_2) U3.47(VSS_3) U5.1(GND) USB9.4(ID) USB9.5(GND) USB9.Shell(Shield)
VCC_3V3: C25.1 C26.1 C28.1 C30.1 C31.1 C32.1 C33.1 D20.2(A) D21.2(A) H10.4 J13.1 J13.6 R114.2 U3.9(VDDA) U3.24(VDD_1) U3.36(VDD_2) U3.48(VDD_3) U5.2(VOUT) U5.4(VOUT)
USB_D_N: R108.2 U3.32(PA11) ; port PA11
USB_D_P: R109.2 R110.2 U3.33(PA12) ; port PA12
NetC22_1: C22.1 C23.1
NetC22_2: C22.2 R111.2 U3.5(PD0-OSC_IN) Y1.1 ; port OSC_IN
NetC23_2: C23.2 R111.1 U3.6(PD1-OSC_OUT) Y1.2 ; port OSC_OUT
NetC24_2: C24.2 U3.3(PC14-OSC32_IN) Y2.1 ; port PC14
NetC27_2: C27.2 U3.4(PC15-OSC32_OUT) Y2.4 ; port PC15
NetC29_1: C29.1 R114.1 S1.2 U3.7(NRST) ; port NRST
NetD19_2: D19.2(A) USB9.1(VBUS)
NetD20_1: D20.1(C) R115.2
NetH10_2: H10.2 R113.1 U3.34(PA13) ; port SWDIO
NetH10_3: H10.3 R112.1 U3.37(PA14) ; port SWCLK
NetJ13_2: J13.2 R117.2
NetJ13_5: J13.5 R118.1
NetR108_1: R108.1 USB9.2(D-)
NetR109_1: R109.1 USB9.3(D+)
NetR116_1: R116.1 U3.2(PC13-TAMPER-RTC) ; port PC13
NetR117_1: R117.1 U3.44(BOOT0) ; port BOOT0
NetR118_2: R118.2 U3.20(PB2) ; port BOOT1
NetU3_1: U3.1(VBAT) ; port VBAT
NetU3_10: U3.10(PA0-WKUP) ; port PA0
NetU3_11: U3.11(PA1) ; port PA1
NetU3_12: U3.12(PA2) ; port PA2
NetU3_13: U3.13(PA3) ; port PA3
NetU3_14: U3.14(PA4) ; port PA4
NetU3_15: U3.15(PA5) ; port PA5
NetU3_16: U3.16(PA6) ; port PA6
NetU3_17: U3.17(PA7) ; port PA7
NetU3_18: U3.18(PB0) ; port PB0
NetU3_19: U3.19(PB1) ; port PB1
NetU3_21: U3.21(PB10) ; port PB10
NetU3_22: U3.22(PB11) ; port PB11
NetU3_25: U3.25(PB12) ; port PB12
NetU3_26: U3.26(PB13) ; port PB13
NetU3_27: U3.27(PB14) ; port PB14
NetU3_28: U3.28(PB15) ; port PB15
NetU3_29: U3.29(PA8) ; port PA8
NetU3_30: U3.30(PA9) ; port PA9
NetU3_31: U3.31(PA10) ; port PA10
NetU3_38: U3.38(PA15) ; port PA15
NetU3_39: U3.39(PB3) ; port PB3
NetU3_40: U3.40(PB4) ; port PB4
NetU3_41: U3.41(PB5) ; port PB5
NetU3_42: U3.42(PB6) ; port PB6
NetU3_43: U3.43(PB7) ; port PB7
NetU3_45: U3.45(PB8) ; port PB8
NetU3_46: U3.46(PB9) ; port PB9

Not connected (* = marked no-connect by the designer): D21 1(C); R116 2; Y2 2(NC) 3(NC)

### Layout directives
differential pair: USB_D_N, USB_D_P

### Library data of the parts
C22-C24 C27 = 20pF 0603: 20pF/0.02nF 50V Capacitor 5% Tolerance 0603N200J500CT – 0603 Package; Price per piece: 1.85; Product URL: https://sharvielectronics.com/product/20pf-0-02nf-50v-capacitor-5-tolerance-0603n200j500ct-0603-package/; Datasheet: https://drive.google.com/file/d/1bI-gbXJF8P1uj18nKMNUbX5Mw9ANXnPN/view?usp=sharing
C25 C36 = 10uF 0805: 10uF/1000nF 50V Capacitor ±10% Tolerance CC0805KKX5R9BB106 – 0805 Package; Product URL: https://sharvielectronics.com/product/10uf-1000nf-50v-capacitor-%c2%b110-tolerance-cc0805kkx5r9bb106-0805-package/; Price per piece: 2.85; Datasheet: https://drive.google.com/file/d/1wr2K_YaGqgMtACeU2pC6RWLSxDMrIPxr/view?usp=sharing
C26 C28 C30-C34 = 0.1uF 0805: 0.1uF/100nF 100V Capacitor ±10% Tolerance CC0805KKX7R0BB104 – 0805 Package; Product URL: https://sharvielectronics.com/product/0-1uf-100nf-100v-capacitor-%c2%b110-tolerance-cc0805kkx7r0bb104-0805-package/; Price per piece: 4.76; Datasheet: https://drive.google.com/file/d/1wr2K_YaGqgMtACeU2pC6RWLSxDMrIPxr/view?usp=sharing
C29 C35 = 1uF 0805: 1uF/1000nF 50V Capacitor ±10% Tolerance CC0805KKX7R9BB105 – 0805 Package; Price per piece: 2.16; Product URL: https://sharvielectronics.com/product/1uf-1000nf-50v-capacitor-%c2%b110-tolerance-cc0805kkx7r9bb105-0805-package/; Datasheet: https://drive.google.com/file/d/1wr2K_YaGqgMtACeU2pC6RWLSxDMrIPxr/view?usp=sharing
D19 = CMP-0303-00003-3: DIODE SCHOTTKY 40V 1A SOD123; Forward Voltage: 450mV; Capacitance: 110pF; Max Forward Surge Current (Ifsm): 25A; Peak Reverse Current: 50uA; Polarity: Standard; Element Configuration: Single; Max Power Dissipation: 450mW; Min Operating Temperature: -65°C; Package Quantity: 3000; Contact Plating: Tin; Weight: 0.000353oz; Max Repetitive Reverse Voltage (Vrrm): 40V; Max Reverse Voltage (DC): 40V; Height: 1.25mm; Average Rectified Current: 1A; Width: 1.7mm; Case/Package: SOD-123-2; Lead Free: Lead Free; Max Operating Temperature: 125°C; Current Rating: 1A; Termination: SMD/SMT; Forward Current: 1A; Radiation Hardening: No; Number of Pins: 2; Length: 2.85mm; Voltage Rating (DC): 40V; REACH SVHC: No SVHC; Peak Non-Repetitive Surge Current: 25A; Packaging: Tape and Reel; Output Current: 1A; Price per piece: 7.45; Product URL: https://sharvielectronics.com/product/1n5819hw-schottky-diodes-sod-123-package/; Datasheet: https://sharvielectronics.com/wp-content/uploads/2022/02/1N5819HW-Schottky-Diodes-SOD-123-Package.pdf\
D20 = LED-0805: Green LED -0805 SMD Package 17-21/GHC-XS1T2M/3T; Price per piece: 1.85; Product URL: https://sharvielectronics.com/product/green-led-0805-smd-package-17-21-ghc-xs1t2m-3t/; Datasheet: https://everlighteurope.com/index.php?controller=attachment&id_attachment=5819
D21 = LED-0805: as D16 on sheet optocouplers2; Price per piece: 2.32; Product URL: https://sharvielectronics.com/product/red-led-0805-smd-package-17-21surc-s530-a3-tr8/; Datasheet: https://drive.google.com/file/d/193qGY45iPx2JlzACJk7ZLn2axHlG04VY/view?usp=sharing
H10 = 2.54mm 4p header: 1X40 40 Pin Straight Breakaway Male Header 11mm Height Yellow – 2.54mm Pitch; Price per piece: 11.85; Product URL: https://sharvielectronics.com/product/1x40-40-pin-straight-breakaway-male-header-11mm-height-yellow-2-54mm-pitch/; Datasheet: https://sharvielectronics.com/wp-content/uploads/2023/12/2.54mm-Pin-Header-Single-Row-Straight.pdf
J13 = 2.54mm berg 3p: 40×2 Pin Male Berg Strip Break Away Header Right Angle- 2.54mm Pitch; Price per piece: 12.25; Product URL: https://sharvielectronics.com/product/40x2-pin-male-berg-strip-break-away-header-right-angle-2-54mm-pitch/; Datasheet: https://www.mouser.com/catalog/additional/Amphenol_bwb_bergstik.pdf
R108 R109 = R0805: 22 Ohm 1/8 Watt Resistor 1% Tolerance RC0805FR-0722RL – 0805 Package; Price per piece: 0.82; Product URL: https://sharvielectronics.com/product/22-ohm-1-8-watt-resistor-1-tolerance-rc0805fr-0722rl-0805-package/; Datasheet: https://drive.google.com/file/d/1pkLQT_RQ1i35oFQcGREpZr7Oy3Ppi-ZT/view?usp=sharing
R110 = R0805: 1.5K Ohm 1/8 Watt Resistor 1% Tolerance 0805W8F1501T5E – 0805 Package; Price per piece: 0.82; Product URL: https://sharvielectronics.com/product/1-5k-ohm-1-8-watt-resistor-1-tolerance-0805w8f1501t5e-0805-package/; Datasheet: https://drive.google.com/file/d/1rtx85iFJaMrDbsv7PAzG9bTFItPmAE38/view?usp=sharing
R111 = R0603: 1M Ohm 1/10 Watt Resistor 1% Tolerance RC0603FR-071ML – 0603 Package; Price per Piece: 0.87; Product URL: https://sharvielectronics.com/product/1m-ohm-1-10-watt-resistor-1-tolerance-rc0603fr-071ml-0603-package/; Datasheet: https://drive.google.com/file/d/1pkLQT_RQ1i35oFQcGREpZr7Oy3Ppi-ZT/view?usp=sharing
R112-R114 = 10k 0805: as R87 on sheet optocouplers2; Price per piece: 0.82; Product URL: https://sharvielectronics.com/product/10k-ohm-1-8-watt-resistor-1-tolerance-rc0805fr-0710kl-0805-package/; Datasheet: https://drive.google.com/file/d/1pkLQT_RQ1i35oFQcGREpZr7Oy3Ppi-ZT/view?usp=sharing
R115 R116 = R0805: as R89 on sheet optocouplers2; Price per piece: 0.85; Product URL: https://sharvielectronics.com/product/510-ohm-1-8-watt-resistor-1-tolerance-0805s8f5100t5e-0805-package/; Datasheet: https://drive.google.com/file/d/1rtx85iFJaMrDbsv7PAzG9bTFItPmAE38/view
R117 R118 = R0805: 100K Ohm 1/8 Watt Resistor 1% Tolerance 0805W8F1003T5E – 0805 Package; Price per piece: 0.89; Product URL: https://sharvielectronics.com/product/100k-ohm-1-8-watt-resistor-1-tolerance-0805w8f1003t5e-0805-package/; Datasheet: https://drive.google.com/file/d/1rtx85iFJaMrDbsv7PAzG9bTFItPmAE38/view?usp=sharing
S1 = PBUTTON: TS36CA-0.6 – 2Pin SPST SMD Right Angle Push Button Switch; Price per piece: 4.52; Product URL: https://sharvielectronics.com/product/ts36ca-0-6-2pin-spst-smd-right-angle-push-button-switch/; Datasheet: https://drive.google.com/file/d/11nXDBprwehBhuTnyyi6cyPbdFHQP9C3O/view?usp=sharing
U3 = CMP-0237-00215-3: STM32F103C8T6 ARM Microcontroller – LQFP-48 Package; Core: ARM Cortex-M3; Supply Voltage(Vcc) min (V): 2; Packing: Tray; Internal RAM Size (kB): 20; FLASH Size (Prog) (kB): 64; A/D Converter: 2x12-bit (10 Channel); I/Os (High Current): 37; Operating Frequency(F) (Processor speed) (MHz): 72; ComponentLink3Description: Package Specification; Mounting Technology: Surface Mount; PartNumber: STM32F103C8T6; PackageReference: LQFP48; ComponentLink3URL: http://www.st.com/st-web-ui/static/active/en/resource/technical/document/datasheet/DM00058181.pdf; DatasheetVersion: Rev. 16; ComponentLink1URL: http://www.st.com/web/en/home.html; PackageVersion: Rev. 6, 06/2013; ComponentLink2URL: http://www.st.com/st-web-ui/static/active/en/resource/technical/document/datasheet/CD00161566.pdf; ComponentLink1Description: Manufacturer URL; ComponentLink2Description: Datasheet; PackageDescription: 48-Pin Low Profile Quad Flat Package, 7 x 7 mm Body, 0.5 mm Pitch; Price per piece: 189.45; Product URL: https://sharvielectronics.com/product/stm32f103c8t6-arm-microcontroller-lqfp-48-package/; Datasheet: https://www.st.com/resource/en/datasheet/stm32f103c8.pdf
U5 = AMS1117-3V3: AMS1117 3.3V – Voltage Regulator IC SMD SOT-223 Package; Price per piece: 6.25; Product URL: https://sharvielectronics.com/product/ams1117-3-3v-voltage-regulator-ic-smd-sot-223-package/; Datasheet: https://sharvielectronics.com/wp-content/uploads/2020/09/AMS1117-3.3V_DS.pdf
USB9 = CMP-1502-03253-2: Micro USB 2.0 B Type Connector 5 Pin SMD; NexarPartId: 19991173; Insulation Resistance: 1GΩ; Contact Resistance: 30mΩ; Number of Contacts: 5; Number of Ports: 1; Gender: Receptacle; Current Rating: 1A; Voltage Rating: 30V; USB Standard: USB 2.0; Plating: Nickel; Max Operating Temperature: 105°C; Orientation: Horizontal; Height: 2.9mm; Termination: Solder; Min Operating Temperature: -40°C; Number of Pins: 5; Flammability Rating: UL94 V-0; Lead Free: Lead Free; Packaging: Tape and Reel; Contact Plating: Gold; RoHS: Compliant; Connector Type: USB; Mount: Horizontal, Surface Mount; Color: Black; REACH SVHC: Unknown; Operating Supply Voltage: 30V; Contact Material: Copper; Number of Positions: 5; Length: 5.9mm; Price per piece: 12.45; Product URL: https://sharvielectronics.com/product/micro-usb-2-0-b-type-connector-5-pin-smd/; Datasheet: https://sharvielectronics.com/wp-content/uploads/2020/06/Micro-USB-2.0-B-type-5-Pin-Connector.pdf
Y1 = CMP-2100-03639-1: HC-49SMD 8MHz Surface Mount Crystal 20PF Oscillator – X49SM8MSD2SC; Manufacturer: FOX Electronics; Series Resistance: 80Ohm; Tolerance: 50ppm; Frequency Tolerance: 30ppm; Datasheet URL: http://www.foxonline.com/pdfs/hc49sdlf.pdf; Package Reference: HC49SDLF; Height: 4.5mm; Mount: SurfaceMount; Packaging: TapeandReel; Length: 11.7mm; Termination: SMD/SMT; Number of Pins: 2; Depth: 5mm; Frequency: 8MHz; Min Operating Temperature: -20degC; Package Quantity: 1000; Load Capacitance: 20pF; RoHSCompliant: True; Lead Free: LeadFree; Width: 5mm; Case/Package: SMD/SMT; Manufacturer URL: http://www.foxonline.com/; Max Operating Temperature: 70degC; REACH SVHC: NoSVHC; Datasheet Version: 42064.0; Package Description: 2-Pin Surface Mount Device, Body 5 x 11.7 mm; Frequency Stability: 50ppm; ESR (Equivalent Series Resistance): 80Ohm; Radiation Hardening: No; Price per piece: 9.5; Product URL: https://sharvielectronics.com/product/hc-49smd-8mhz-surface-mount-crystal-20pf-oscillator-x49sm8msd2sc/; Datasheet: *
Y2 = 32.768 Khz: YSX306GA 32.768 Khz SMD Crystal; Price per piece: 28.69; Product URL: https://sharvielectronics.com/product/ysx306ga-32-768-khz-smd-crystal/; Datasheet: https://drive.google.com/file/d/15lCHrTLPlPWCqCXLaHcSvA8fcw05laDJ/view?usp=sharing

## Nets that join several sheets
15V_GND: Gate_Driver (15 pins), Optocouplers (6 pins), optocouplers2 (6 pins), Precharge circuit (Q25.3 Q26.3), mcu (U?.2)
+5V_GATE_DRV: Gate_Driver (6 pins), Optocouplers (12 pins), optocouplers2 (Q?#2.4 R86.2 R87.2 R?#3.2), Precharge circuit (D17.1 D18.1 K7.2 K8.2)
+5V_MCU: Current_measurement (8 pins), Voltage_measurement (6 pins), Optocouplers (6 pins), Precharge circuit (8 pins), mcu (U?.3)
+48V: HV_Side (8 pins), Voltage_measurement (R45.2), Precharge circuit (J8.1 R95.2)
A_GND: Current_measurement (12 pins), Voltage_measurement (7 pins), Optocouplers (12 pins), optocouplers2 (Q22.2 Q23.3 R?#6.1), Precharge circuit (7 pins), mcu (13 pins)
HV_GND: HV_Side (14 pins), Gate_Driver (R?#1.2 U1.13), Voltage_measurement (R53.1 R54.1), Precharge circuit (R98.1)
VCC_15V: Gate_Driver (11 pins), optocouplers2 (Q24.3), mcu (U?.1)
NetC14_1: Current_measurement (C14.1 R41.2 U2.8), mcu (H8.39)
NetD3_1: HV_Side (D3.1 D6.1 R3.1 R9.1), Gate_Driver (U1.27)
NetD4_1: HV_Side (D4.1 D7.1 R4.1 R10.1), Gate_Driver (U1.23)
NetD5_1: HV_Side (D5.1 D8.1 R5.1 R11.1), Gate_Driver (U1.19)
NetD9_1: HV_Side (D9.1 D12.1 R15.1 R21.1), Gate_Driver (U1.16)
NetD10_1: HV_Side (D10.1 D13.1 R16.1 R22.1), Gate_Driver (U1.15)
NetD11_1: HV_Side (D11.1 D14.1 R17.1 R23.1), Gate_Driver (U1.14)
NetH8_19: Precharge circuit (J10.1 R104.1 R106.2), mcu (H8.19)
NetH8_21: Precharge circuit (J11.1 R105.1 R107.2), mcu (H8.21)
NetH8_29: Precharge circuit (J9.3 R101.1), mcu (H8.29)
NetH8_30: Precharge circuit (J9.2 R102.1), mcu (H8.30)
NetH8_31: Precharge circuit (J9.1 R103.1), mcu (H8.31)
NetH8_41: Current_measurement (R37.2), mcu (H8.41)
NetH8_43: Voltage_measurement (R50.1), mcu (H8.43)
NetH8_47: optocouplers2 (Q?#2.1), mcu (H8.47)
NetH8_48: Precharge circuit (R100.1), mcu (H8.48)
NetH8_49: Precharge circuit (R99.1), mcu (H8.49)
NetH8_50: optocouplers2 (R88.1), mcu (H8.50)
NetH8_51: optocouplers2 (R89.2), mcu (H8.51)
NetH8_54: Optocouplers (R79.1), mcu (H8.54)
NetH8_56: Optocouplers (R77.1), mcu (H8.56)
NetH8_58: Optocouplers (R66.1), mcu (H8.58)
NetH8_60: Optocouplers (R78.1), mcu (H8.60)
NetH8_62: Optocouplers (R67.1), mcu (H8.62)
NetH8_64: Optocouplers (R65.1), mcu (H8.64)
NetQ16_6: Gate_Driver (R2.1), Optocouplers (Q16.6)
NetQ17_6: Gate_Driver (R27.1), Optocouplers (Q17.6)
NetQ18_6: Gate_Driver (R28.1), Optocouplers (Q18.6)
NetQ19_6: Gate_Driver (R29.1), Optocouplers (Q19.6)
NetQ20_6: Gate_Driver (R30.1), Optocouplers (Q20.6)
NetQ21_6: Gate_Driver (R31.1), Optocouplers (Q21.6)
NetQ?#1_3: Gate_Driver (U1.9), optocouplers2 (Q?#1.3 R?#4.2)
NetR32_1: Gate_Driver (R32.1), optocouplers2 (R86.1 R90.2)
NetR33_1: Gate_Driver (R33.1), optocouplers2 (R87.1 R91.1)
NetR38_2: Current_measurement (R38.2 R40.2), optocouplers2 (R?#2.1)
PHASE_A: HV_Side (6 pins), Gate_Driver (C1.2 U1.26)
PHASE_B: HV_Side (6 pins), Gate_Driver (C2.2 U1.22)
PHASE_C: HV_Side (6 pins), Gate_Driver (C6.2 U1.18)